# Altium schematic sheet Deathsound_preamp_channel.SchDoc
size A4
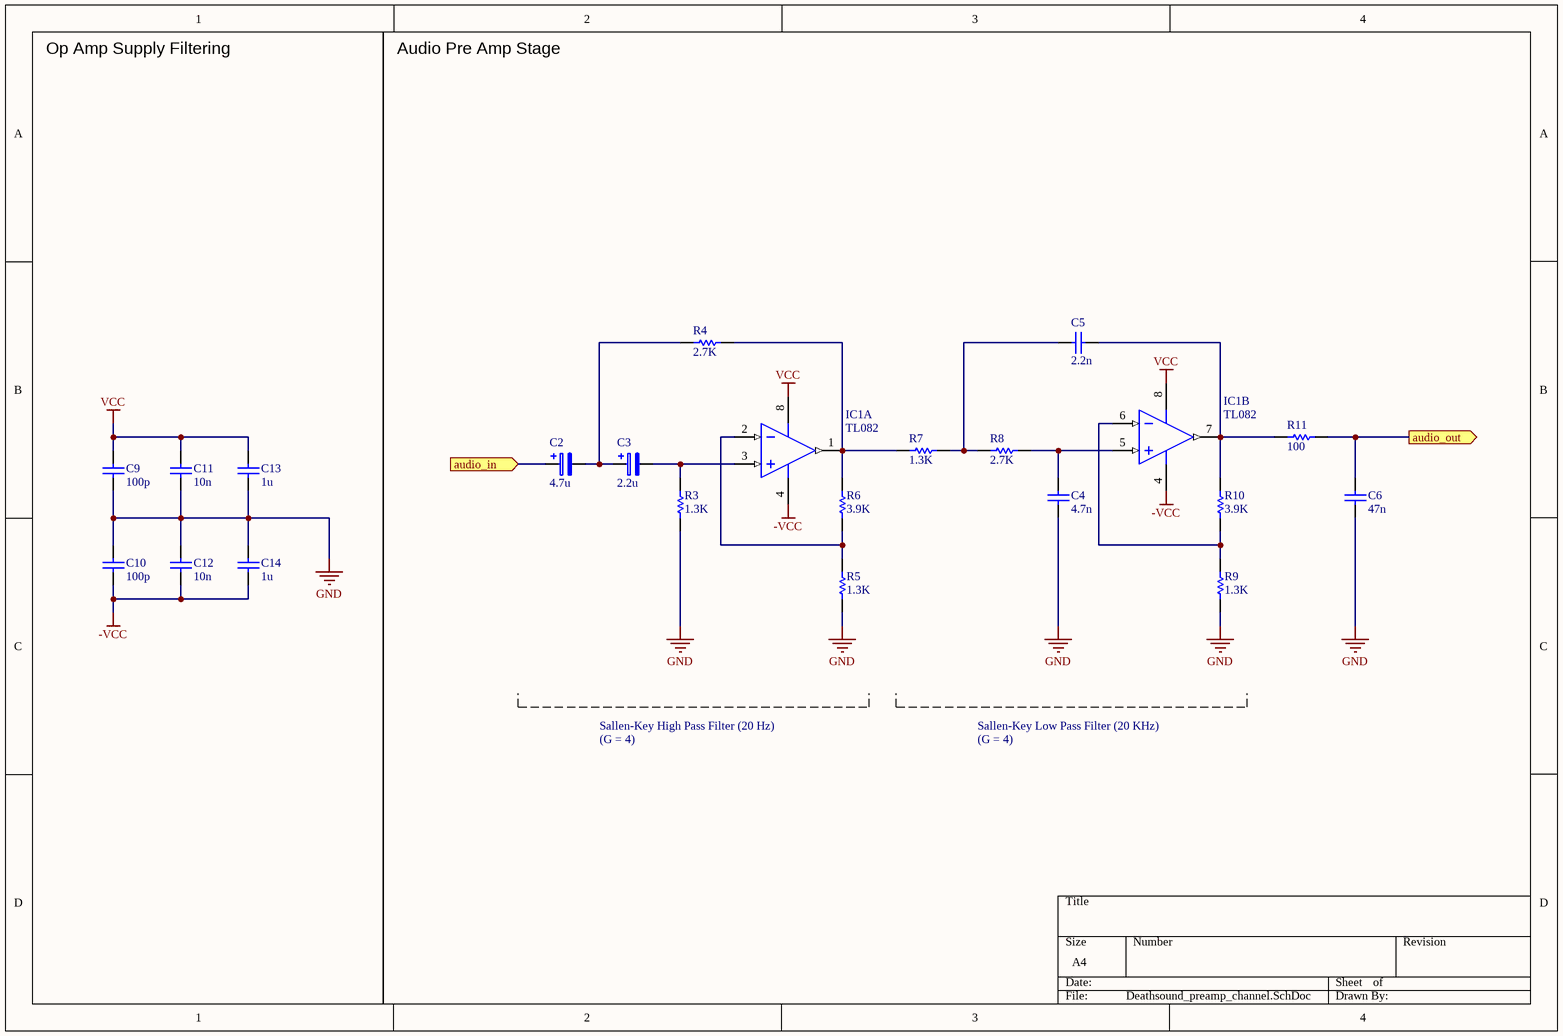
[diagram p0: Deathsound_preamp_channel.SchDoc]

## Parts
C2  4.7u  [CRADIAL-2mm]
C3  2.2u  [CRADIAL-2mm]
C4  4.7n  [C0805]
C5  2.2n  [C0805]
C6  47n  [C1206]
C9  100p  [C0805]
C10  100p  [C0805]
C11  10n  [C0805]
C12  10n  [C0805]
C13  1u  [C0805]
C14  1u  [C0805]
IC1  TL082  [SOIC127P600X175-8N]  (parts A,B of 2)
R3  1.3K  [R0805]
R4  2.7K  [R0805]
R5  1.3K  [R0805]
R6  3.9K  [R0805]
R7  1.3K  [R0805]
R8  2.7K  [R0805]
R9  1.3K  [R0805]
R10  3.9K  [R0805]
R11  100  [R0805]

## Ports
audio_in (in), audio_out (out)

## Nets
-VCC: C10.1 C12.1 C14.1 IC1.4(V-)
GND: C4.1 C6.1 C9.1 C10.2 C11.1 C12.2 C13.1 C14.2 R3.1 R5.2 R9.1
VCC: C9.2 C11.2 C13.2 IC1.8(V+)
audio_in: C2.1 ; port audio_in
audio_out: C6.2 R11.1 ; port audio_out
NetC2_2: C2.2 C3.1 R4.2
NetC3_2: C3.2 IC1.3(IN+1) R3.2
NetC4_2: C4.2 IC1.5(IN+2) R8.2
NetC5_1: C5.1 IC1.7(OUT2) R10.2 R11.2
NetC5_2: C5.2 R7.2 R8.1
NetIC1_1: IC1.1(OUT1) R4.1 R6.1 R7.1
NetIC1_2: IC1.2(IN-1) R5.1 R6.2
NetIC1_6: IC1.6(IN-2) R9.2 R10.1

## Notes on the sheet
- Op Amp Supply Filtering
- Audio Pre Amp Stage
- Sallen-Key High Pass Filter (20 Hz)
- (G = 4)
- Sallen-Key Low Pass Filter (20 KHz)

## Library data of the parts
C2 C3 = Pol Capacitor: Polarized Capacitor
  C2: Value: 4.7u
  C3: Value: 2.2u
C4-C6 C9-C14 = Capacitor
  C4: Value: 4.7n
  C5: Value: 2.2n
  C6: Value: 47n
  C9 C10: Value: 100p
  C11 C12: Value: 10n
  C13 C14: Value: 1u
R3-R11 = Resistor
  R3 R5 R7 R9: Value: 1.3K
  R4 R8: Value: 2.7K
  R6 R10: Value: 3.9K
  R11: Value: 100